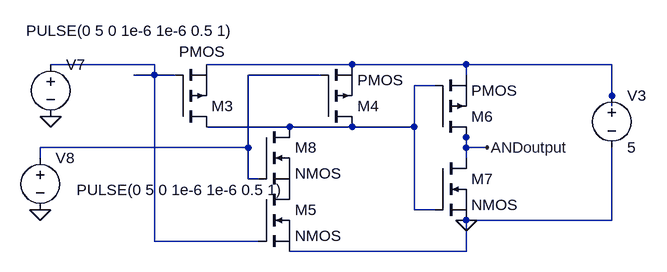
[diagram p0: schematic and.asc]
and.asc, the LTspice schematic file:
Version 4
SHEET 1 2860 680
WIRE -304 112 -464 112
WIRE 0 112 -224 112
WIRE 176 112 0 112
WIRE 400 112 176 112
WIRE -304 128 -304 112
WIRE -304 128 -336 128
WIRE -272 128 -304 128
WIRE -48 128 -160 128
WIRE 176 128 176 112
WIRE 128 144 96 144
WIRE 400 160 400 112
WIRE 400 176 400 160
WIRE -96 208 -224 208
WIRE 0 208 -96 208
WIRE 96 208 96 144
WIRE 96 208 0 208
WIRE 176 224 176 208
WIRE -160 240 -160 128
WIRE -160 240 -480 240
WIRE 176 240 176 224
WIRE 208 240 176 240
WIRE -480 256 -480 240
WIRE 176 256 176 240
WIRE -160 288 -160 240
WIRE -144 288 -160 288
WIRE 96 336 96 208
WIRE 128 336 96 336
WIRE 400 352 400 240
WIRE 400 352 176 352
WIRE -304 384 -304 128
WIRE -144 384 -304 384
WIRE 176 400 176 352
WIRE 176 400 -96 400
FLAG 208 240 ANDoutput
FLAG 176 352 0
FLAG -464 192 0
FLAG -480 336 0
SYMBOL pmos -272 208 M180
WINDOW 3 6 116 Left 2
SYMATTR InstName M3
SYMBOL pmos -48 208 M180
SYMATTR InstName M4
SYMBOL pmos 128 224 M180
SYMATTR InstName M6
SYMBOL nmos 128 256 R0
SYMATTR InstName M7
SYMBOL voltage 400 144 R0
WINDOW 123 0 0 Left 2
WINDOW 39 0 0 Left 2
SYMATTR InstName V3
SYMATTR Value 5
SYMBOL nmos -144 304 R0
SYMATTR InstName M5
SYMBOL nmos -144 208 R0
SYMATTR InstName M8
SYMBOL voltage -464 96 R0
WINDOW 123 0 0 Left 2
WINDOW 39 0 0 Left 2
WINDOW 3 -38 -36 Left 2
SYMATTR Value PULSE(0 5 0 1e-6 1e-6 0.5 1)
SYMATTR InstName V7
SYMBOL voltage -480 240 R0
WINDOW 123 0 0 Left 2
WINDOW 39 0 0 Left 2
WINDOW 3 56 65 Left 2
SYMATTR Value PULSE(0 5 0 1e-6 1e-6 0.5 1)
SYMATTR InstName V8

The netlist it stands for:
* and.asc
M3 N004 N001 N002 N002 PMOS
M4 N004 N003 N002 N002 PMOS
M6 ANDoutput N004 N002 N002 PMOS
M7 ANDoutput N004 0 0 NMOS
V3 N002 0 5
M5 P001 N001 0 0 NMOS
M8 N004 N003 P001 P001 NMOS
V7 N001 0 PULSE(0 5 0 1e-6 1e-6 0.5 1)
V8 N003 0 PULSE(0 5 0 1e-6 1e-6 0.5 1)
.model NMOS NMOS
.model PMOS PMOS
.lib standard.mos
.backanno
.end